# Altium schematic sheet Sheet2.SchDoc
size B; SheetNumber: 2; SheetTotal: 6
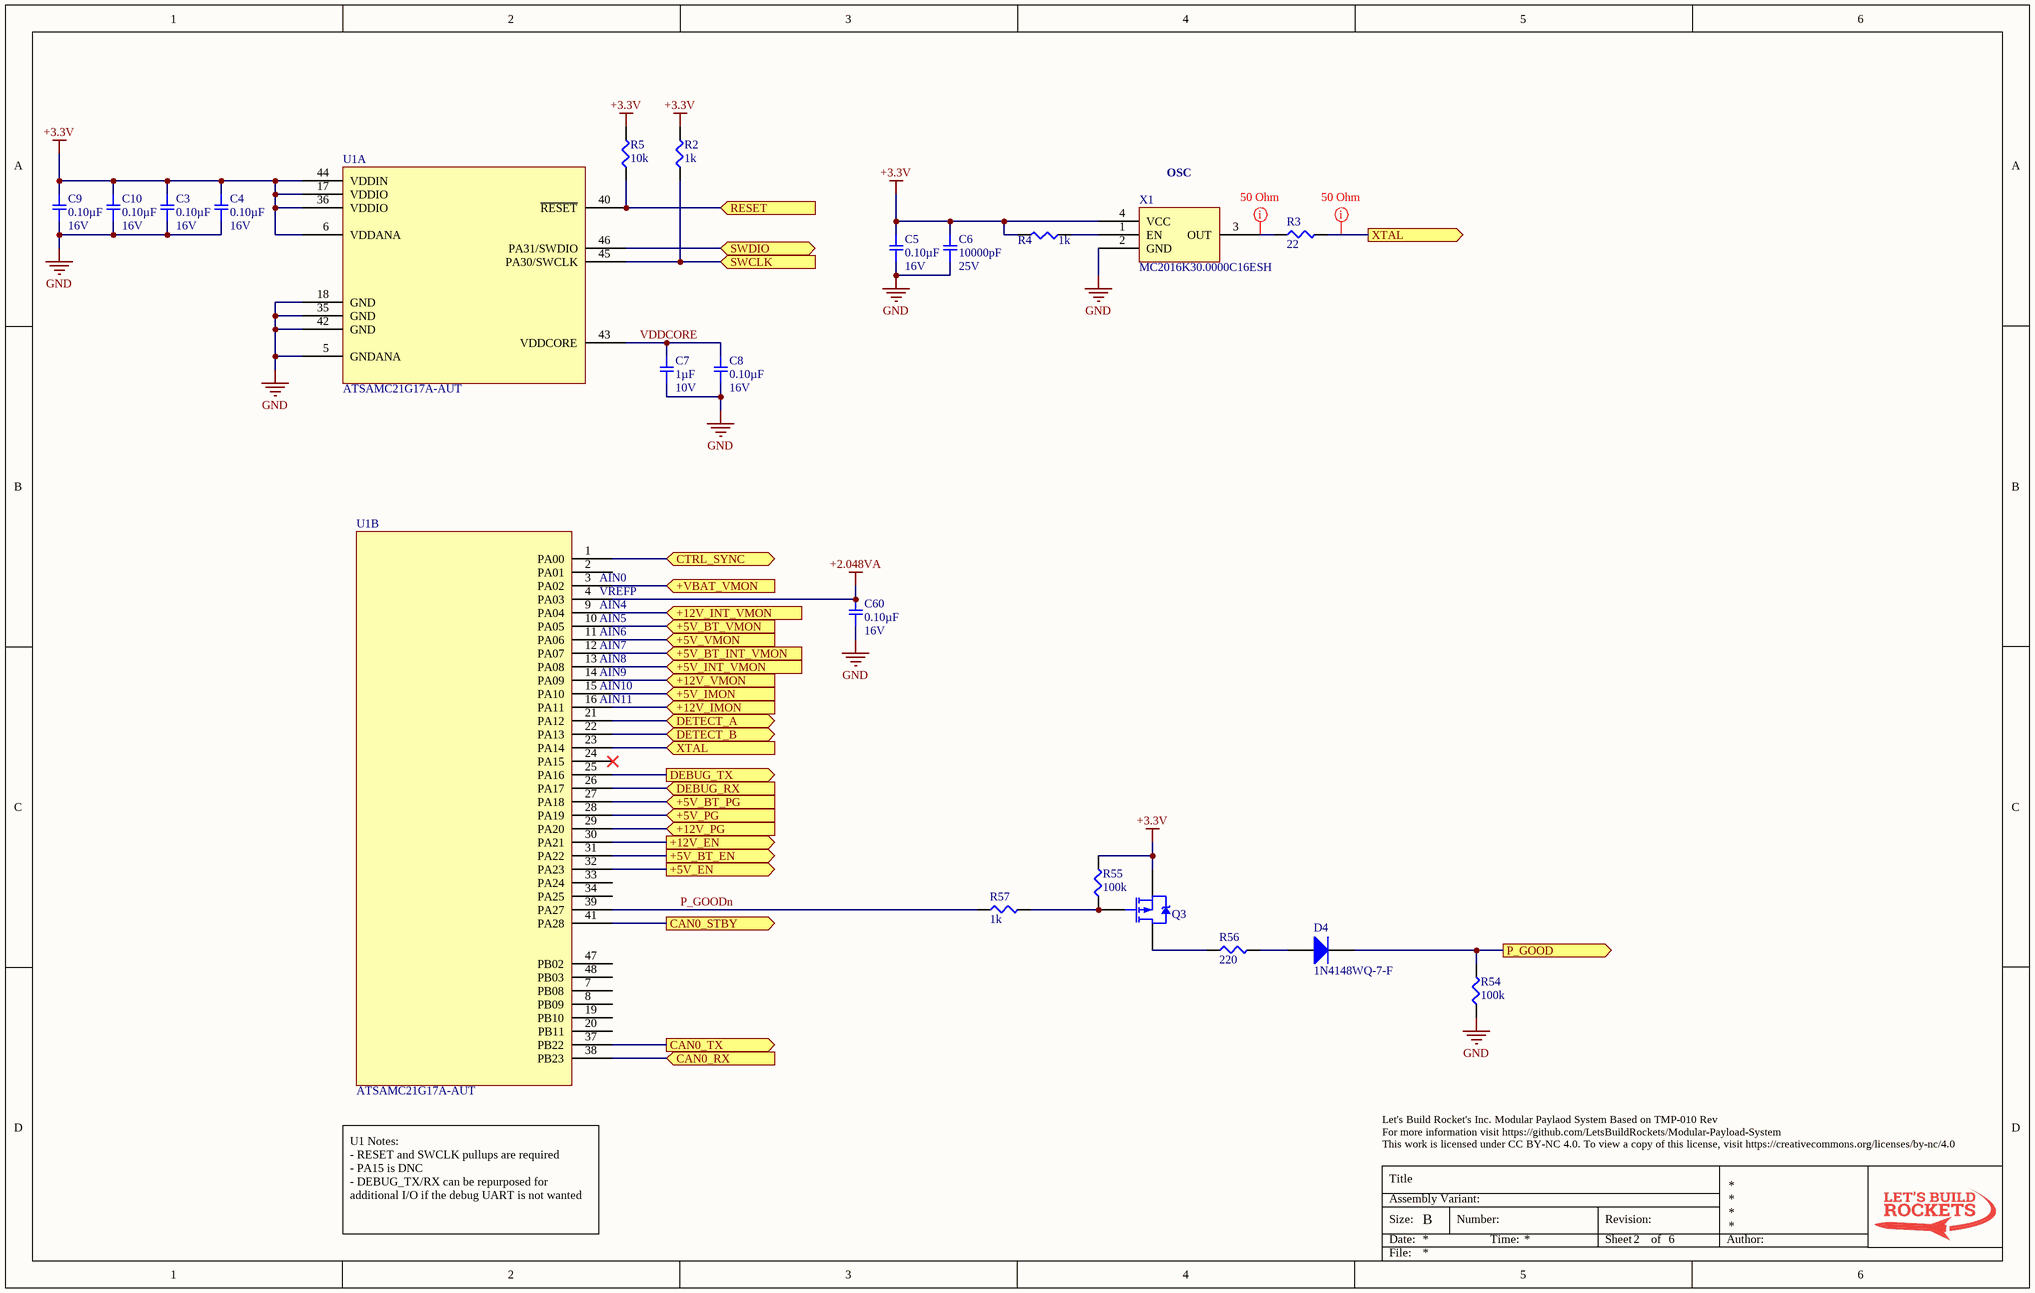
[diagram p0: Sheet2.SchDoc]

## Parts
C3  0.10µF  Voltage: 16V  [SMD-0402C]
C4  0.10µF  Voltage: 16V  [SMD-0402C]
C5  0.10µF  Voltage: 16V  [SMD-0402C]
C6  10000pF  Voltage: 25V  [SMD-0402C]
C7  1µF  Voltage: 10V  [SMD-0402C]
C8  0.10µF  Voltage: 16V  [SMD-0402C]
C9  0.10µF  Voltage: 16V  [SMD-0402C]
C10  0.10µF  Voltage: 16V  [SMD-0402C]
C60  0.10µF  Voltage: 16V  [SMD-0402C]
D4  1N4148WQ-7-F  [SOD123]
Q3  BSS84AK,215  [SOT95P230X110-3N (BSS84)]  (value not drawn)
R2  1k  [SMD-0402-RES]
R3  22  [SMD-0402-RES]
R4  1k  [SMD-0402-RES]
R5  10k  [SMD-0402-RES]
R54  100k  [SMD-0402-RES]
R55  100k  [SMD-0402-RES]
R56  220  [SMD-0402-RES]
R57  1k  [SMD-0402-RES]
U1  ATSAMC21G17A-AUT  [TSQFP50P900X900X120-48N]  (parts A,B of 2)
X1  MC2016K30.0000C16ESH  [MC2016]

## Ports
+5V_BT_EN (out), +5V_BT_INT_VMON (in), +5V_BT_PG (in), +5V_BT_VMON (in), +5V_EN (out), +5V_IMON (in), +5V_INT_VMON (in), +5V_PG (in), +5V_VMON (in), +12V_EN (out), +12V_IMON (in), +12V_INT_VMON (in), +12V_PG (in), +12V_VMON (in), +VBAT_VMON (in), CAN0_RX (in), CAN0_STBY (out), CAN0_TX (out), CTRL_SYNC (bidir), DEBUG_RX (in), DEBUG_TX (out), DETECT_A (bidir), DETECT_B (bidir), P_GOOD (out), RESET (in), SWCLK (in), SWDIO (bidir), XTAL (in), XTAL (out)

## Nets
+2.048VA: C60.2 U1.4(PA03)
+3.3V: C3.2 C4.2 C5.2 C6.2 C9.2 C10.2 Q3.S R2.2 R4.2 R5.2 R55.2 U1.6(VDDANA) U1.17(VDDIO) U1.36(VDDIO) U1.44(VDDIN) X1.4(VCC)
GND: C3.1 C4.1 C5.1 C6.1 C7.1 C8.1 C9.1 C10.1 C60.1 R54.1 U1.5(GNDANA) U1.18(GND) U1.35(GND) U1.42(GND) X1.2(GND)
+5V_BT_EN: U1.31(PA22) ; port +5V_BT_EN
+5V_BT_INT_VMON: U1.12(PA07) ; port +5V_BT_INT_VMON
+5V_BT_PG: U1.27(PA18) ; port +5V_BT_PG
+5V_BT_VMON: U1.10(PA05) ; port +5V_BT_VMON
+5V_EN: U1.32(PA23) ; port +5V_EN
+5V_IMON: U1.15(PA10) ; port +5V_IMON
+5V_INT_VMON: U1.13(PA08) ; port +5V_INT_VMON
+5V_PG: U1.28(PA19) ; port +5V_PG
+5V_VMON: U1.11(PA06) ; port +5V_VMON
+12V_EN: U1.30(PA21) ; port +12V_EN
+12V_IMON: U1.16(PA11) ; port +12V_IMON
+12V_INT_VMON: U1.9(PA04) ; port +12V_INT_VMON
+12V_PG: U1.29(PA20) ; port +12V_PG
+12V_VMON: U1.14(PA09) ; port +12V_VMON
+VBAT_VMON: U1.3(PA02) ; port +VBAT_VMON
CAN0_RX: U1.38(PB23) ; port CAN0_RX
CAN0_STBY: U1.41(PA28) ; port CAN0_STBY
CAN0_TX: U1.37(PB22) ; port CAN0_TX
CTRL_SYNC: U1.1(PA00) ; port CTRL_SYNC
DEBUG_RX: U1.26(PA17) ; port DEBUG_RX
DEBUG_TX: U1.25(PA16) ; port DEBUG_TX
DETECT_A: U1.21(PA12) ; port DETECT_A
DETECT_B: U1.22(PA13) ; port DETECT_B
P_GOOD: D4.K R54.2 ; port P_GOOD
P_GOODn: R57.1 U1.39(PA27)
RESET: R5.1 U1.40(~{RESET}) ; port RESET
SWCLK: R2.1 U1.45(PA30/SWCLK) ; port SWCLK
SWDIO: U1.46(PA31/SWDIO) ; port SWDIO
VDDCORE: C7.2 C8.2 U1.43(VDDCORE)
XTAL: R3.2 U1.23(PA14) ; port XTAL
NetD4_A: D4.A R56.2
NetQ3_D: Q3.D R56.1
NetQ3_G: Q3.G R55.1 R57.2
NetR3_1: R3.1 X1.3(OUT)
NetR4_1: R4.1 X1.1(EN)

Not connected (* = marked no-connect by the designer): U1 2(PA01) 7(PB08) 8(PB09) 19(PB10) 20(PB11) 24(PA15)* 33(PA24) 34(PA25) 47(PB02) 48(PB03)

## Layout directives
rule Width Constraint [Pref Impedance = 50.00ohms    Min Impedance = 50.00ohms    Max Impedance = 50.00ohms]: NetR3_1, XTAL

## Notes on the sheet
- (near X1) OSC
- (near U1) AIN0
- (near U1) AIN4
- (near U1) VREFP
- (near U1) AIN5
- (near U1) AIN6
- (near U1) AIN7
- (near U1) AIN8
- (near U1) AIN9
- (near U1) AIN10
- (near U1) AIN11
- U1 Notes:
  - RESET and SWCLK pullups are required
  - PA15 is DNC
  - DEBUG_TX/RX can be repurposed for additional I/O if the debug UART is not wanted
- Let's Build Rocket's Inc. Modular Paylaod System Based on TMP-010 Rev
  For more information visit https://github.com/LetsBuildRockets/Modular-Payload-System
  This work is licensed under CC BY-NC 4.0. To view a copy of this license, visit https://creativecommons.org/licenses/by-nc/4.0
- Title
- Size:
- Date:
- Assembly Variant:
- B
- Number:
- Time:
- Revision:
- Sheet
- of
- Author:
- File:

## Library data of the parts
C3-C5 C8-C10 C60 = GCM155R71C104KA55D: CAP CER 0.1UF 16V X7R 0402; Manufacturer: Murata Electronics North America; Factory Stock: 0; Unit Price (USD): 0.1; Minimum Quantity: 1; Tolerance: ±10%; Datasheets: http://www.murata.com/~/media/webrenewal/support/library/catalog/products/capacitor/mlcc/c03e.ashx; Image: //media.digikey.com/Renders/Murata%20Renders/ZRB-SERIES-0402.jpg; Digi-Key Part Number: 490-4759-1-ND; Part Number: GCM155R71C104KA55D; Quantity Available: 734194; @ qty: 0; Packaging: Cut Tape (CT); Series: GCM; Part Status: Active; Value: 0.10µF; Temperature Coefficient: X7R; Operating Temperature: -55°C ~ 125°C; Features: -; Ratings: AEC-Q200; Applications: Automotive; Mounting Type: Surface Mount, MLCC; Package / Case: 0402 (1005 Metric); Size / Dimension: 0.039" L x 0.020" W (1.00mm x 0.50mm); Height - Seated (Max): -; Thickness (Max): 0.022" (0.55mm); Lead Spacing: -; Lead Style: -
C6 = GCM155R71E103KA37D: CAP CER 10000PF 25V X7R 0402; Manufacturer: Murata Electronics North America; Factory Stock: 0; Unit Price (USD): 0.1; Minimum Quantity: 1; Tolerance: ±10%; Datasheets: http://www.murata.com/~/media/webrenewal/support/library/catalog/products/capacitor/mlcc/c03e.ashx; Image: //media.digikey.com/Renders/Murata%20Renders/ZRB-SERIES-0402.jpg; Digi-Key Part Number: 490-6043-1-ND; Part Number: GCM155R71E103KA37D; Quantity Available: 128782; @ qty: 0; Packaging: Cut Tape (CT); Series: GCM; Part Status: Active; Value: 10000pF; Temperature Coefficient: X7R; Operating Temperature: -55°C ~ 125°C; Features: -; Ratings: AEC-Q200; Applications: Automotive; Mounting Type: Surface Mount, MLCC; Package / Case: 0402 (1005 Metric); Size / Dimension: 0.039" L x 0.020" W (1.00mm x 0.50mm); Height - Seated (Max): -; Thickness (Max): 0.022" (0.55mm); Lead Spacing: -; Lead Style: -
C7 = GCM155C71A105KE38D: CAP CER 1UF 10V X7S 0402; Manufacturer: Murata Electronics North America; Factory Stock: 0; Unit Price (USD): 0.12; Minimum Quantity: 1; Tolerance: ±10%; Datasheets: http://www.murata.com/~/media/webrenewal/support/library/catalog/products/capacitor/mlcc/c03e.ashx; Image: //media.digikey.com/Renders/Murata%20Renders/ZRB-SERIES-0402.jpg; Digi-Key Part Number: 490-13409-1-ND; Part Number: GCM155C71A105KE38D; Quantity Available: 7240; @ qty: 0; Packaging: Cut Tape (CT); Series: GCM; Part Status: Active; Value: 1µF; Temperature Coefficient: X7S; Operating Temperature: -55°C ~ 125°C; Features: -; Ratings: AEC-Q200; Applications: Automotive; Mounting Type: Surface Mount, MLCC; Package / Case: 0402 (1005 Metric); Size / Dimension: 0.039" L x 0.020" W (1.00mm x 0.50mm); Height - Seated (Max): -; Thickness (Max): 0.022" (0.55mm); Lead Spacing: -; Lead Style: -
D4 = 1N4148WQ-7-F: Unit Price (USD): 0.19
Q3 = BSS84AK,215: Rds: 7.5ohms; Vgs: 20V; Power Dissipation: 420mW; Id: 180mA; VDS: 50V; Qg: 0.26nC; Ciss: 36pF; Unit Price (USD): 0.20; Operating Temperature: -55°C ~ 150°C
R2 R4 R57 = ERJ-2GEJ102X: RES SMD 1K OHM 5% 1/10W 0402; Manufacturer: Panasonic Electronic Components; Factory Stock: 0; Unit Price (USD): 0.00350; @ qty: 1500; Minimum Quantity: 1; Power (Watts): 0.1W, 1/10W; Temperature Coefficient: ±200ppm/°C; Part Number: ERJ-2GEJ102X; Datasheets: http://industrial.panasonic.com/www-cgi/jvcr13pz.cgi?E+PZ+3+AOA0001+ERJ2GEJ102X+7+WW; Image: //media.digikey.com/Photos/Panasonic%20Photos/ERJ-PA2-Series.jpg; Digi-Key Part Number: P1.0KJCT-ND; Quantity Available: 1939857; Packaging: Cut Tape (CT); Series: ERJ; Part Status: Active; Value: 1k; Tolerance: ±5%; Composition: Thick Film; Features: Automotive AEC-Q200; Operating Temperature: -55°C ~ 155°C; Package / Case: 0402 (1005 Metric); Supplier Device Package: 0402; Size / Dimension: 0.039" L x 0.020" W (1.00mm x 0.50mm); Height - Seated (Max): 0.016" (0.40mm); Number of Terminations: 2; Failure Rate: -
R3 = ERJ-2RKF22R0X: RES SMD 22 OHM 1% 1/10W 0402; Manufacturer: Panasonic Electronic Components; Factory Stock: 0; Unit Price (USD): 0.00496; @ qty: 1500; Minimum Quantity: 1; Power (Watts): 0.1W, 1/10W; Temperature Coefficient: ±100ppm/°C; Part Number: ERJ-2RKF22R0X; Datasheets: http://industrial.panasonic.com/www-cgi/jvcr13pz.cgi?E+PZ+3+AOA0002+ERJ2RKF22R0X+7+WW; Image: //media.digikey.com/Photos/Panasonic%20Photos/ERJ-PA2-Series.jpg; Digi-Key Part Number: P22.0LCT-ND; Quantity Available: 620432; Packaging: Cut Tape (CT); Series: ERJ; Part Status: Active; Value: 22; Tolerance: ±1%; Composition: Thick Film; Features: Automotive AEC-Q200; Operating Temperature: -55°C ~ 155°C; Package / Case: 0402 (1005 Metric); Supplier Device Package: 0402; Size / Dimension: 0.039" L x 0.020" W (1.00mm x 0.50mm); Height - Seated (Max): 0.016" (0.40mm); Number of Terminations: 2; Failure Rate: -
R5 = ERJ-2GEJ103X: RES SMD 10K OHM 5% 1/10W 0402; Manufacturer: Panasonic Electronic Components; Factory Stock: 0; Unit Price (USD): 0.00350; @ qty: 1500; Minimum Quantity: 1; Power (Watts): 0.1W, 1/10W; Temperature Coefficient: ±200ppm/°C; Part Number: ERJ-2GEJ103X; Datasheets: http://industrial.panasonic.com/www-cgi/jvcr13pz.cgi?E+PZ+3+AOA0001+ERJ2GEJ103X+7+WW; Image: //media.digikey.com/Photos/Panasonic%20Photos/ERJ-PA2-Series.jpg; Digi-Key Part Number: P10KJCT-ND; Quantity Available: 2560215; Packaging: Cut Tape (CT); Series: ERJ; Part Status: Active; Value: 10k; Tolerance: ±5%; Composition: Thick Film; Features: Automotive AEC-Q200; Operating Temperature: -55°C ~ 155°C; Package / Case: 0402 (1005 Metric); Supplier Device Package: 0402; Size / Dimension: 0.039" L x 0.020" W (1.00mm x 0.50mm); Height - Seated (Max): 0.016" (0.40mm); Number of Terminations: 2; Failure Rate: -
R54 R55 = ERJ-2GEJ104X: RES SMD 100K OHM 5% 1/10W 0402; Manufacturer: Panasonic Electronic Components; Factory Stock: 0; Unit Price (USD): 0.00350; @ qty: 1500; Minimum Quantity: 1; Power (Watts): 0.1W, 1/10W; Temperature Coefficient: ±200ppm/°C; Part Number: ERJ-2GEJ104X; Datasheets: http://industrial.panasonic.com/www-cgi/jvcr13pz.cgi?E+PZ+3+AOA0001+ERJ2GEJ104X+7+WW; Image: //media.digikey.com/Photos/Panasonic%20Photos/ERJ-PA2-Series.jpg; Digi-Key Part Number: P100KJCT-ND; Quantity Available: 2387986; Packaging: Cut Tape (CT); Series: ERJ; Part Status: Active; Value: 100k; Tolerance: ±5%; Composition: Thick Film; Features: Automotive AEC-Q200; Operating Temperature: -55°C ~ 155°C; Package / Case: 0402 (1005 Metric); Supplier Device Package: 0402; Size / Dimension: 0.039" L x 0.020" W (1.00mm x 0.50mm); Height - Seated (Max): 0.016" (0.40mm); Number of Terminations: 2; Failure Rate: -
R56 = ERJ-2GEJ221X: RES SMD 220 OHM 5% 1/10W 0402; Manufacturer: Panasonic Electronic Components; Factory Stock: 0; Unit Price (USD): 0.00350; @ qty: 1500; Minimum Quantity: 1; Power (Watts): 0.1W, 1/10W; Temperature Coefficient: ±200ppm/°C; Part Number: ERJ-2GEJ221X; Datasheets: http://industrial.panasonic.com/www-cgi/jvcr13pz.cgi?E+PZ+3+AOA0001+ERJ2GEJ221X+7+WW; Image: //media.digikey.com/Photos/Panasonic%20Photos/ERJ-PA2-Series.jpg; Digi-Key Part Number: P220JCT-ND; Quantity Available: 702646; Packaging: Cut Tape (CT); Series: ERJ; Part Status: Active; Value: 220; Tolerance: ±5%; Composition: Thick Film; Features: Automotive AEC-Q200; Operating Temperature: -55°C ~ 155°C; Package / Case: 0402 (1005 Metric); Supplier Device Package: 0402; Size / Dimension: 0.039" L x 0.020" W (1.00mm x 0.50mm); Height - Seated (Max): 0.016" (0.40mm); Number of Terminations: 2; Failure Rate: -
U1 = ATSAMC21G17A-AUT: Unit Price (USD): 2.35
X1 = MC2016K30.0000C16ESH: Unit Price (USD): 2.37